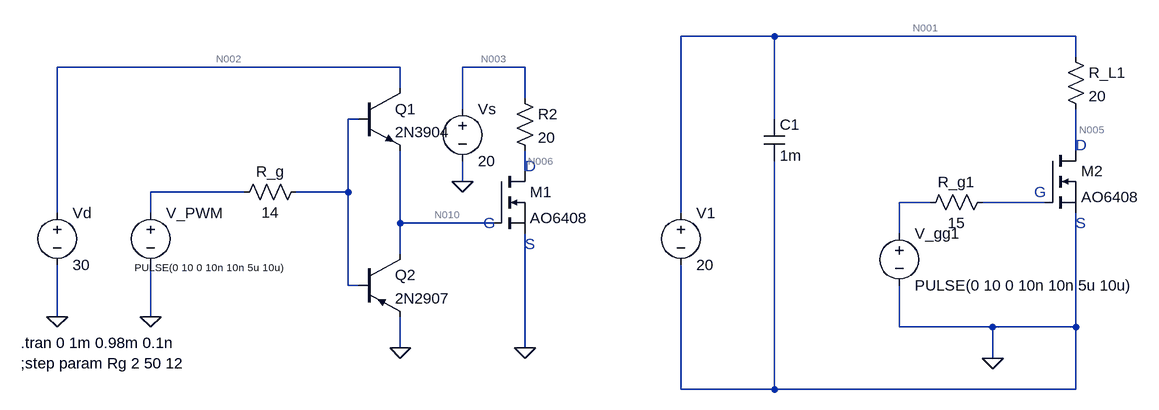
[diagram p0: schematic task1_model2.asc]
task1_model2.asc, the LTspice schematic file:
Version 4
SHEET 1 1584 680
WIRE 1008 -144 864 -144
WIRE 1472 -144 1008 -144
WIRE 1472 -112 1472 -144
WIRE 432 -96 -96 -96
WIRE 624 -96 528 -96
WIRE 432 -64 432 -96
WIRE 624 -48 624 -96
WIRE 528 -32 528 -96
WIRE 368 -16 352 -16
WIRE 1008 -16 1008 -144
WIRE 1472 32 1472 -32
WIRE 624 64 624 32
WIRE 528 80 528 48
WIRE 192 96 48 96
WIRE 352 96 352 -16
WIRE 352 96 272 96
WIRE 1248 112 1200 112
WIRE 1424 112 1328 112
WIRE -96 128 -96 -96
WIRE 48 128 48 96
WIRE 864 128 864 -144
WIRE 432 144 432 32
WIRE 576 144 432 144
WIRE 1200 160 1200 112
WIRE 432 192 432 144
WIRE 352 240 352 96
WIRE 368 240 352 240
WIRE -96 288 -96 208
WIRE 48 288 48 208
WIRE 1200 304 1200 240
WIRE 1344 304 1200 304
WIRE 1472 304 1472 128
WIRE 1472 304 1344 304
WIRE 432 336 432 288
WIRE 624 336 624 160
WIRE 1344 352 1344 304
WIRE 864 400 864 208
WIRE 1008 400 1008 48
WIRE 1008 400 864 400
WIRE 1472 400 1472 304
WIRE 1472 400 1008 400
FLAG 48 288 0
FLAG -96 288 0
FLAG 432 336 0
FLAG 624 336 0
FLAG 528 80 0
FLAG 1344 352 0
SYMBOL voltage 48 112 R0
WINDOW 3 -25 100 Left 1
WINDOW 123 0 0 Left 0
WINDOW 39 0 0 Left 0
SYMATTR Value PULSE(0 10 0 10n 10n 5u 10u)
SYMATTR InstName V_PWM
SYMBOL res 288 80 R90
WINDOW 0 0 56 VBottom 2
WINDOW 3 32 56 VTop 2
SYMATTR InstName R_g
SYMATTR Value 14
SYMBOL npn 368 -64 R0
SYMATTR InstName Q1
SYMATTR Value 2N3904
SYMBOL pnp 368 192 R0
SYMATTR InstName Q2
SYMATTR Value 2N2907
SYMBOL nmos 576 64 R0
SYMATTR InstName M1
SYMATTR Value AO6408
SYMBOL voltage -96 112 R0
WINDOW 123 0 0 Left 0
WINDOW 39 0 0 Left 0
SYMATTR InstName Vd
SYMATTR Value 30
SYMBOL voltage 528 -48 R0
WINDOW 123 0 0 Left 0
WINDOW 39 0 0 Left 0
SYMATTR InstName Vs
SYMATTR Value 20
SYMBOL res 608 -64 R0
SYMATTR InstName R2
SYMATTR Value 20
SYMBOL voltage 1200 144 R0
WINDOW 123 0 0 Left 0
WINDOW 39 0 0 Left 0
SYMATTR InstName V_gg1
SYMATTR Value PULSE(0 10 0 10n 10n 5u 10u)
SYMBOL nmos 1424 32 R0
SYMATTR InstName M2
SYMATTR Value AO6408
SYMBOL res 1344 96 R90
WINDOW 0 0 56 VBottom 2
WINDOW 3 32 56 VTop 2
SYMATTR InstName R_g1
SYMATTR Value 15
SYMBOL res 1456 -128 R0
SYMATTR InstName R_L1
SYMATTR Value 20
SYMBOL cap 992 -16 R0
SYMATTR InstName C1
SYMATTR Value 1m
SYMBOL voltage 864 112 R0
WINDOW 123 0 0 Left 0
WINDOW 39 0 0 Left 0
SYMATTR InstName V1
SYMATTR Value 20
TEXT -152 328 Left 2 !.tran 0 1m 0.98m 0.1n
TEXT 560 144 Left 2 ;G
TEXT 624 56 Left 2 ;D
TEXT 624 176 Left 2 ;S
TEXT -152 360 Left 2 !;step param Rg 2 50 12
TEXT 1408 96 Left 2 ;G
TEXT 1472 24 Left 2 ;D
TEXT 1472 144 Left 2 ;S

The netlist it stands for:
* task1_model2.asc
V_PWM N007 0 PULSE(0 10 0 10n 10n 5u 10u)
R_g N004 N007 14
Q1 N002 N004 N010 0 2N3904
Q2 N010 N004 0 0 2N2907
M1 N006 N010 0 0 AO6408
Vd N002 0 30
Vs N003 0 20
R2 N003 N006 20
V_gg1 N008 0 PULSE(0 10 0 10n 10n 5u 10u)
M2 N005 N009 0 0 AO6408
R_g1 N009 N008 15
R_L1 N001 N005 20
C1 N001 0 1m
V1 N001 0 20
.model NPN NPN
.model PNP PNP
.lib standard.bjt
.model NMOS NMOS
.model PMOS PMOS
.lib standard.mos
.tran 0 1m 0.98m 0.1n
* G
* D
* S
;step param Rg 2 50 12
* G
* D
* S
.backanno
.end

* Results of the author's LTspice run, read from the files saved beside the schematic
* Operating Point, zero values left out:
*   V(n002) = 30 V
*   V(n010) = 4.296 mV
*   V(n006) = 20 V
*   V(n003) = 20 V
*   V(n005) = 20 V
*   V(n001) = 20 V
*   Ic(Q1) = 29.98 pA
*   Ib(Q1) = -30.01 pA
*   Id(M2) = 983.7 pA
*   Is(M2) = -983.7 pA
*   Id(M1) = 1.067 nA
*   Is(M1) = -1.067 nA
*   I(R_l1) = 1.004 nA
*   I(R2) = 1.087 nA
*   I(R_g) = 30.01 pA
*   I(V1) = -1.004 nA
*   I(Vs) = -1.087 nA
*   I(Vd) = -30.01 pA
*   I(V_pwm) = 30.01 pA
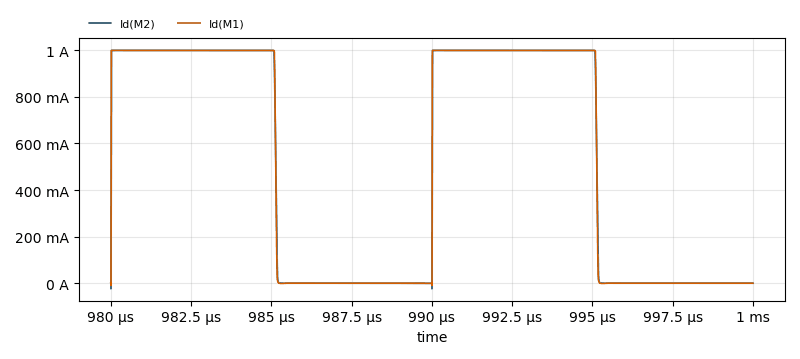
[diagram p1: Transient Analysis of task1_model2.asc, plotted from the saved traces]
* Transient Analysis, 1 run:
*   Id(M2): min -24.04 mA, max 999.6 mA, average 512.5 mA, rms 714.3 mA, last 0 A
*   Id(M1): min -11.09 mA, max 999.6 mA, average 512.7 mA, rms 714.8 mA, last 32.92 µA